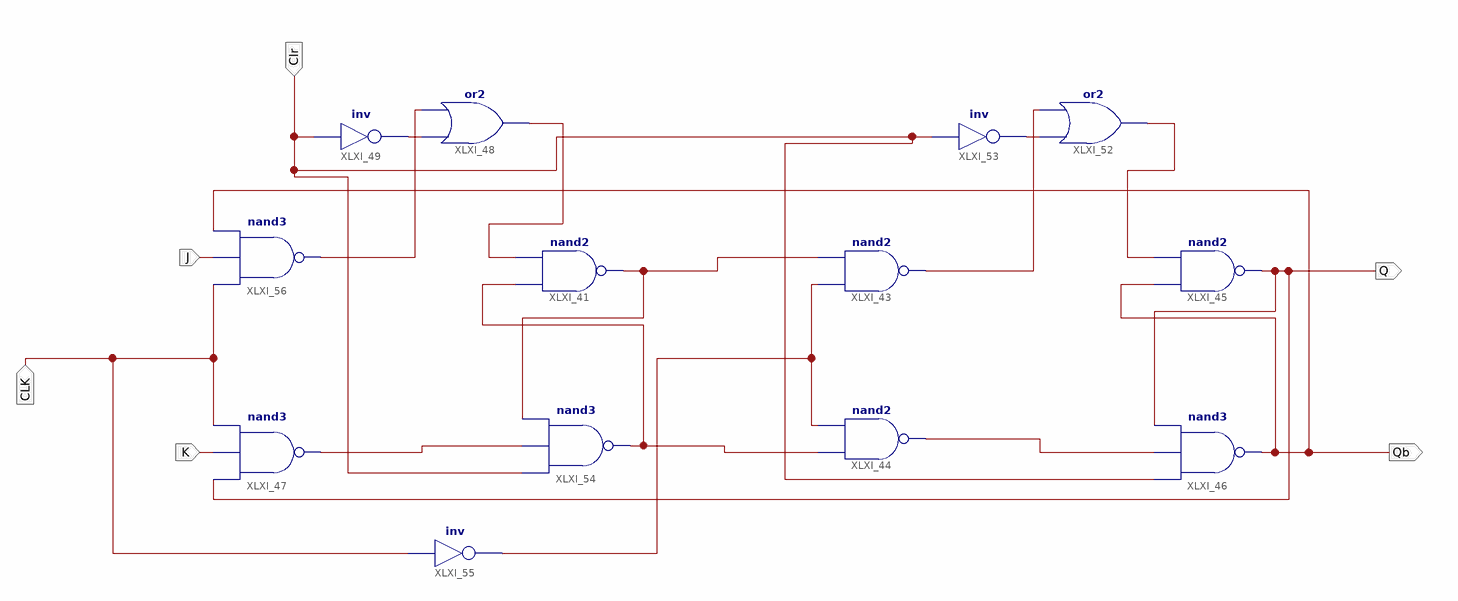
[diagram p0: schematic sheet 1]
// Xilinx ISE schematic MSJK.sch (spartan3a) as structural Verilog: 13 symbols, 6 ports
module MSJK (
  input  J,
  input  K,
  input  Clr,
  input  CLK,
  output Q,
  output Qb
);

  wire XLXN_81, XLXN_84, XLXN_85, XLXN_88, XLXN_91, XLXN_92, XLXN_93, XLXN_99, XLXN_100, XLXN_102, XLXN_105;

  nand XLXI_41 (XLXN_100, XLXN_99, XLXN_85);
  nand XLXI_43 (XLXN_91, XLXN_102, XLXN_100);
  nand XLXI_44 (XLXN_92, XLXN_99, XLXN_102);
  nand XLXI_45 (Q, Qb, XLXN_93);
  nand XLXI_46 (Qb, Clr, XLXN_92, Q);
  nand XLXI_47 (XLXN_88, Q, K, CLK);
  or XLXI_48 (XLXN_85, XLXN_81, XLXN_105);
  not XLXI_49 (XLXN_81, Clr);
  or XLXI_52 (XLXN_93, XLXN_84, XLXN_91);
  not XLXI_53 (XLXN_84, Clr);
  nand XLXI_54 (XLXN_99, Clr, XLXN_88, XLXN_100);
  not XLXI_55 (XLXN_102, CLK);
  nand XLXI_56 (XLXN_105, CLK, J, Qb);
endmodule
